# EAGLE design XRONOS_CLOCK_V2.1 (EAGLE 6.3)
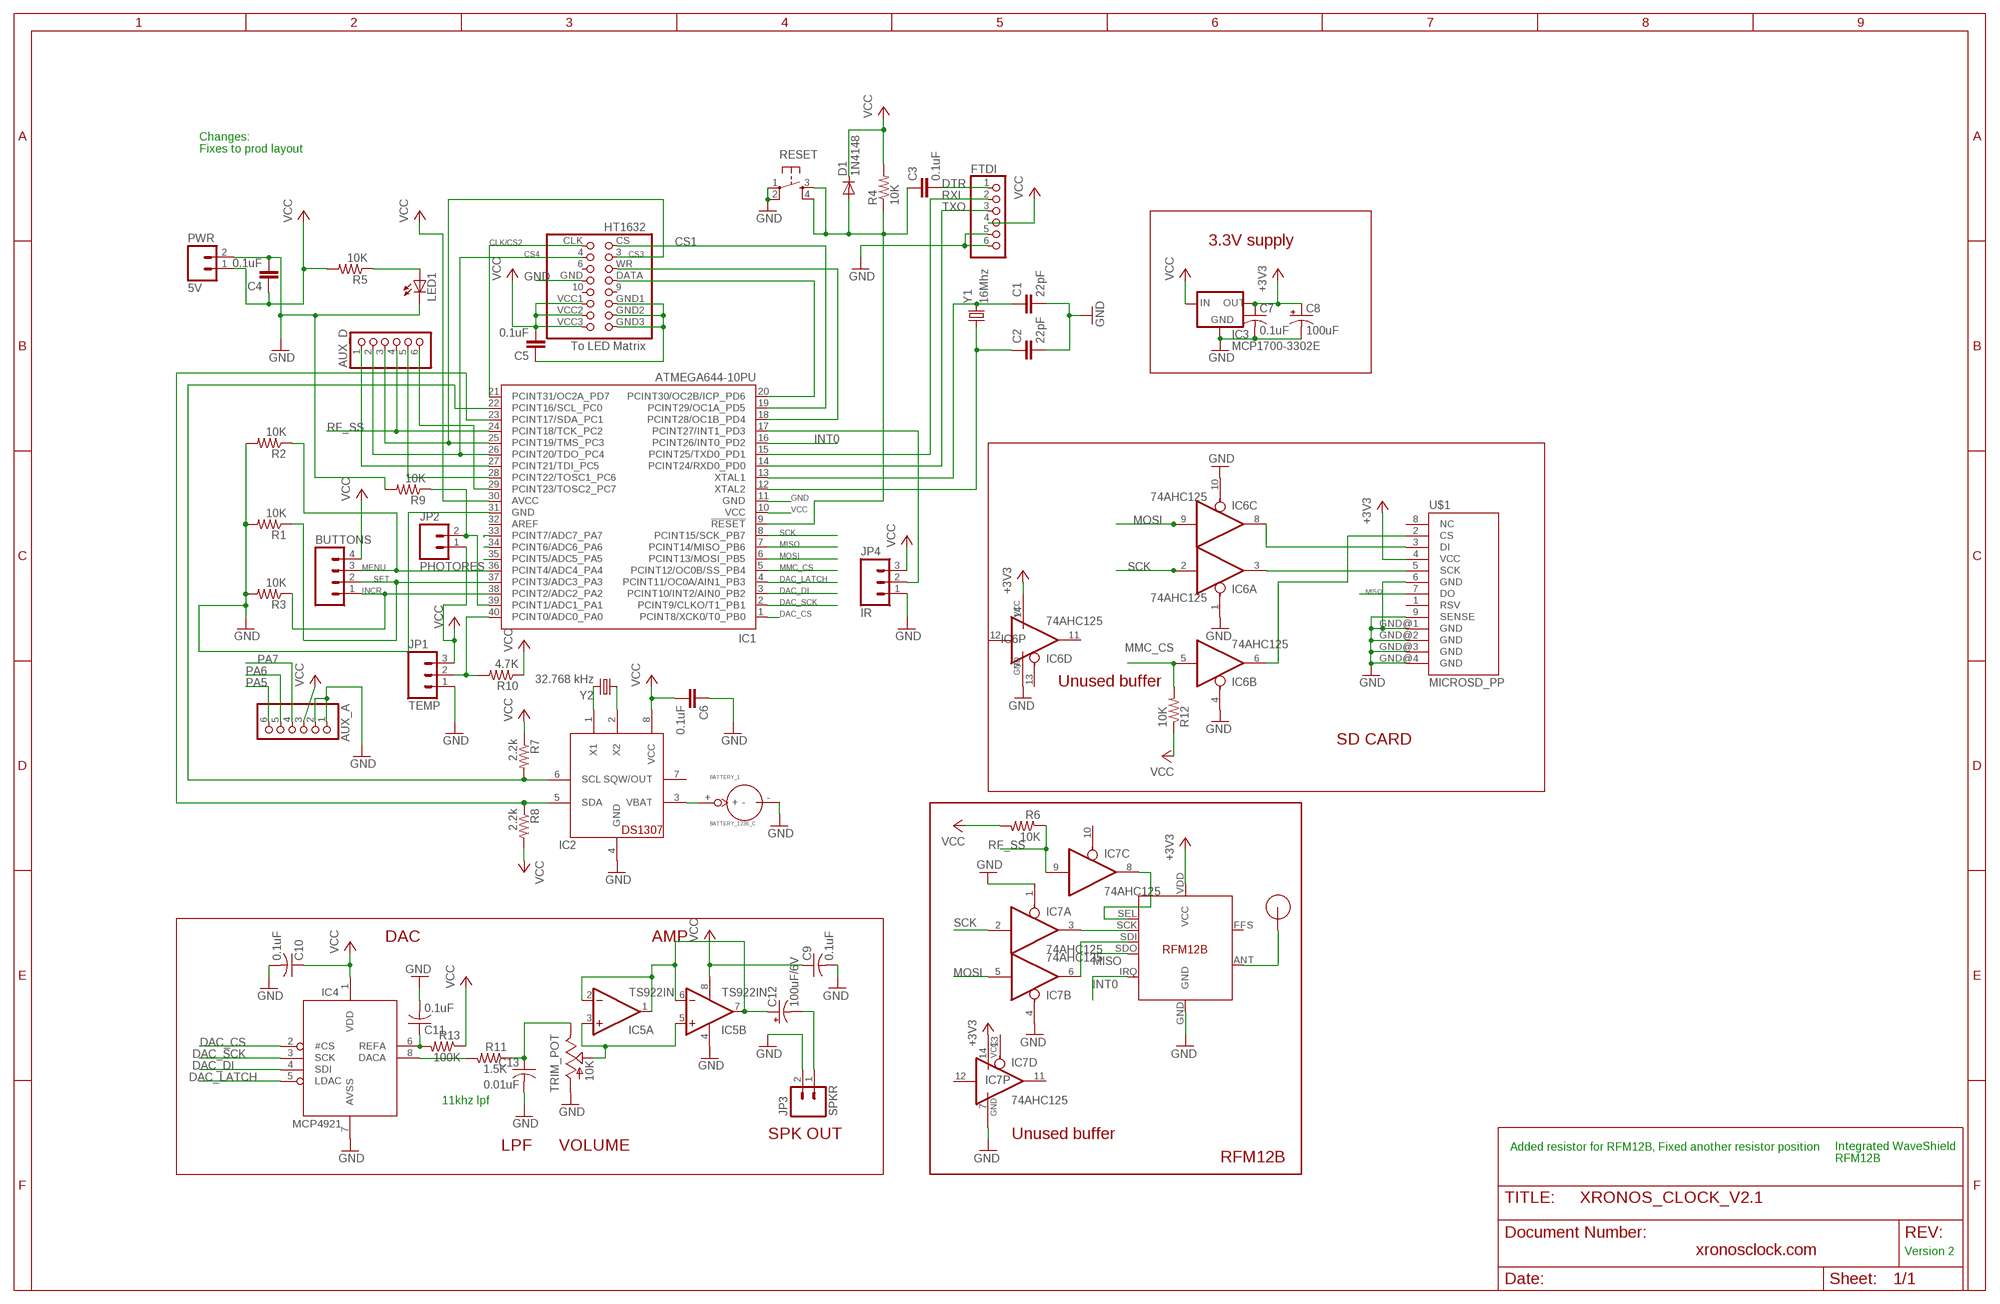
[diagram p0: schematic, sheet 1]

## Parts
AUX_A  PINHD-1X6  [1X06]
AUX_D  PINHD-1X6  [1X06]
BATTERY_1  BATTERY_1236_C  [BATTERY_1236_C]
BUTTONS  M04POLAR  [MOLEX-1X4]
C1  22pF  C-EU025-024X044  [C025-024X044]
C2  22pF  C-EU025-024X044  [C025-024X044]
C3  0.1uF  C-EU025-024X044  [C025-024X044]
C4  0.1uF  C-EU025-024X044  [C025-024X044]
C5  0.1uF  C-EU025-024X044  [C025-024X044]
C6  0.1uF  C-EU025-024X044  [C025-024X044]
C7  0.1uF  C-US025-025X050  [C025-025X050]
C8  100uF  CPOL-USE2.5-5  [E2,5-5]
C9  0.1uF  C-US025-025X050  [C025-025X050]
C10  0.1uF  C-US025-025X050  [C025-025X050]
C11  0.1uF  C-US025-025X050  [C025-025X050]
C12  100uF/6V  CPOL-USE2.5-5  [E2,5-5]
C13  0.01uF  C-US025-025X050  [C025-025X050]
D1  1N4148  1N4148DO35-7  [DO35-7]
FTDI  PINHD-1X6  [1X06]
HT1632  To LED Matrix  HT1632  [IDC2X08]
IC1  ATMEGA644-10PU  [DIL40]
IC2  DS1307  [DIL08]
IC3  MCP1700-3302E  MCP1700TRI  [TO92]
IC4  MCP4921  [DIL08]
IC5  TS922IN  TL072P  [DIL08]
IC6  74AHC125  74125N-LARDO  [DIL14-LARDO]
IC7  74AHC125  74125N  [DIL14]
JP1  TEMP  M03POLAR  [MOLEX-1X3]
JP2  PHOTORES  M02POLAR  [MOLEX-1X2]
JP3  SPKR  M02POLAR  [MOLEX-1X2]
JP4  IR  M03POLAR_LOCK  [MOLEX-1X3_LOCK]
LED1  LED-3MM-NO_SILK  [LED3MM-NS]
PWR  5V  M02POLAR  [MOLEX-1X2]
R1  10K  RESISTOREZ  [AXIAL-0.3EZ]
R2  10K  RESISTOREZ  [AXIAL-0.3EZ]
R3  10K  RESISTOREZ  [AXIAL-0.3EZ]
R4  10K  RESISTOREZ  [AXIAL-0.3EZ]
R5  10K  RESISTOREZ  [AXIAL-0.3EZ]
R6  10K  RESISTORAXIAL-0.3  [AXIAL-0.3]
R7  2.2k  RESISTOREZ  [AXIAL-0.3EZ]
R8  2.2k  RESISTOREZ  [AXIAL-0.3EZ]
R9  10K  RESISTOREZ  [AXIAL-0.3EZ]
R10  4.7K  RESISTOREZ  [AXIAL-0.3EZ]
R11  1.5K  RESISTORAXIAL-0.3  [AXIAL-0.3]
R12  10K  RESISTORAXIAL-0.3  [AXIAL-0.3]
R13  100K  RESISTORAXIAL-0.3  [AXIAL-0.3]
RESET  TAC_SWITCHPTH  [TACTILE-PTH]
TRIM_POT  10K  TRIM_US-B25P  [B25P]
U$1  MICROSD_PP  [MICROSD_PP]
U$2  RFM12B  [RFM12B]
U$3  RFM12B_ANTENNA  [RFM12B-ANTENNA]
Y1  16Mhz  CRYSTALHC49US  [HC49US]
Y2  32.768 kHz  CRYSTALTC26H_EZ  [TC26HEZ]

## Nets
+3V3: C7.1 C8.+ IC3.3(OUT) IC6.14(P:VCC) IC7.14(P:VCC) U$1.4(VCC) U$2.VDD(VCC)
ADJ: IC1.40(PCINT0/ADC0_PA0) JP1.2 R10.P$2
CLK/CS2: HT1632.CLK IC1.21(PCINT31/OC2A_PD7)
CS1: HT1632.CS IC1.19(PCINT29/OC1A_PD5)
CS3: AUX_D.3 HT1632.3 IC1.25(PCINT19/TMS_PC3)
CS4: AUX_D.2 HT1632.4 IC1.26(PCINT20/TDO_PC4)
DAC_CS: IC1.1(PCINT8/XCK0/T0_PB0) IC4.2(#CS)
DAC_DI: IC1.3(PCINT10/INT2/AIN0_PB2) IC4.4(SDI)
DAC_LATCH: IC1.4(PCINT11/OC0A/AIN1_PB3) IC4.5(LDAC)
DAC_SCK: IC1.2(PCINT9/CLKO/T1_PB1) IC4.3(SCK)
DATA: HT1632.DATA IC1.20(PCINT30/OC2B/ICP_PD6)
DTR: C3.2 FTDI.1
GND: AUX_A.1 AUX_A.2 BATTERY_1.- C1.2 C2.2 C4.2 C6.1 C7.2 C8.- C9.2 C10.2 C11.2 C13.2 FTDI.5 FTDI.6 HT1632.GND IC1.11(GND) IC1.31(GND) IC2.4(GND) IC3.1(GND) IC4.7(AVSS) IC5.4(P:V-) IC6.1(A:OE) IC6.4(B:OE) IC6.7(P:GND) IC6.10(C:OE) IC7.1(A:OE) IC7.4(B:OE) IC7.7(P:GND) JP1.1 JP3.2 JP4.1 LED1.K(C) PWR.2 R1.P$2 R2.P$2 R3.P$2 R9.P$2 RESET.1 RESET.2 TRIM_POT.A U$1.6(GND) U$1.9(SENSE) U$1.GND@1(GND) U$1.GND@2(GND) U$1.GND@3(GND) U$1.GND@4(GND) U$2.GND
INCR: BUTTONS.1 IC1.38(PCINT2/ADC2_PA2) R3.P$1
INT0: IC1.16(PCINT26/INT0_PD2) U$2.IRQ
MENU: BUTTONS.3 IC1.36(PCINT4/ADC4_PA4) R2.P$1
MISO: IC1.7(PCINT14/MISO_PB6) U$1.7(DO) U$2.SDO
MMC_CS: IC1.5(PCINT12/OC0B/SS_PB4) IC6.5(B:I) R12.P$2
MOSI: IC1.6(PCINT13/MOSI_PB5) IC6.9(C:I) IC7.5(B:I)
N$2: U$2.ANT U$3.P$1
N$3: C5.1 HT1632.GND1 HT1632.GND2 HT1632.GND3
N$4: IC2.2(X2) Y2.1
N$5: IC2.1(X1) Y2.2
N$6: C1.1 IC1.13(XTAL1) Y1.2
N$7: BATTERY_1.+ IC2.3(VBAT)
N$8: IC7.8(C:O) U$2.SEL
N$9: IC1.17(PCINT27/INT1_PD3) JP4.2
N$11: C2.1 IC1.12(XTAL2) Y1.1
N$13: AUX_D.1 IC1.27(PCINT21/TDI_PC5)
N$14: IC1.39(PCINT1/ADC1_PA1) JP2.2 R9.P$1
N$15: AUX_D.5 IC1.28(PCINT22/TOSC1_PC6)
N$16: AUX_D.6 IC1.29(PCINT23/TOSC2_PC7)
N$17: IC6.8(C:O) U$1.3(DI)
N$18: LED1.A R5.P$1
N$19: IC6.3(A:O) U$1.5(SCK)
N$20: IC6.6(B:O) U$1.2(CS)
N$21: IC4.8(DACA) R11.P$2
N$22: C12.- JP3.1
N$23: C12.+ IC5.1(A:OUT) IC5.2(A:-IN) IC5.6(B:-IN) IC5.7(B:OUT)
N$24: C11.1 IC4.6(REFA) R13.P$2
N$25: IC5.3(A:+IN) IC5.5(B:+IN) TRIM_POT.S
N$26: C13.1 R11.P$1 TRIM_POT.E
N$28: IC7.6(B:O) U$2.SDI
N$30: IC7.3(A:O) U$2.SCK
PA5: AUX_A.6 IC1.35(PCINT5/ADC5_PA5)
PA6: AUX_A.5 IC1.34(PCINT6/ADC6_PA6)
PA7: AUX_A.4 IC1.33(PCINT7/ADC7_PA7)
RESET: C3.1 D1.A IC1.9(!RESET) R4.P$1 RESET.3 RESET.4
RF_SS: AUX_D.4 IC1.24(PCINT18/TCK_PC2) IC7.9(C:I) R6.P$1
RXI: FTDI.2 IC1.15(PCINT25/TXD0_PD1)
SCK: IC1.8(PCINT15/SCK_PB7) IC6.2(A:I) IC7.2(A:I)
SCL: IC1.23(PCINT17/SDA_PC1) IC2.5(SDA) R8.P$1
SDA: IC1.22(PCINT16/SCL_PC0) IC2.6(SCL) R7.P$2
SET: BUTTONS.2 IC1.37(PCINT3/ADC3_PA3) R1.P$1
TXO: FTDI.3 IC1.14(PCINT24/RXD0_PD0)
VCC: AUX_A.3 BUTTONS.4 C4.1 C5.2 C6.2 C9.1 C10.1 D1.C FTDI.4 HT1632.VCC1 HT1632.VCC2 HT1632.VCC3 IC1.10(VCC) IC1.30(AVCC) IC2.8(VCC) IC3.2(IN) IC4.1(VDD) IC5.8(P:V+) JP1.3 JP2.1 JP4.3 PWR.1 R4.P$2 R5.P$2 R6.P$2 R7.P$1 R8.P$2 R10.P$1 R12.P$1 R13.P$1
WR: HT1632.WR IC1.18(PCINT28/OC1B_PD4)
Unconnected: HT1632.6 HT1632.9 HT1632.10 IC1.32(AREF) IC2.7(SQW/OUT) IC6.11(D:O) IC6.12(D:I) IC6.13(D:OE) IC7.10(C:OE) IC7.11(D:O) IC7.12(D:I) IC7.13(D:OE) U$1.1(RSV) U$1.8(NC) U$2.FFS

## Notes on the sheet
- Changes:
  Fixes to prod layout
- 3.3V supply
- Unused buffer
- SD CARD
- DAC | AMP
- 11khz lpf
- SPK OUT | Unused buffer
- LPF | VOLUME | Added resistor for RFM12B, Fixed another resistor position
- RFM12B
- Integrated WaveShield
  RFM12B
- xronosclock.com | Version 2

## Library data of the parts
AUX_A AUX_D FTDI = pinhead:PINHD-1X6: PIN HEADER
BATTERY_1 = Itead_BP_110825:BATTERY_1236_C: SOC004
BUTTONS = SparkFun-Connectors:M04: Header 4 Standard 4-pin 0.1" header. Use with straight break away headers (SKU : PRT-00116), right angle break away headers (PRT-00553), swiss pins (PRT-00743), machine pins (PRT-00117), and female headers (PRT-00115). Molex polarized connector foot print use with SKU : PRT-08231 with associated crimp pins and housings. 1MM SMD Version SKU: PRT-10208
C1-C6 = rcl:C-EU: CAPACITOR, European symbol
C7 C9-C11 C13 = adafruit:C-US: CAPACITOR, American symbol
C8 C12 = adafruit:CPOL-US: POLARIZED CAPACITOR, American symbol
D1 = diode:1N4148: DIODE high speed (Philips)
HT1632 = bratan_headers:HT1632: 2x8 IDC Male Socket
IC1 = atmel:ATMEGA644-*PU: 8-bit Microcontroller with 64K Bytes In-System Programmable Flash Auto generated by make-symbol-device-package-bsdl.ulp Rev. 34 Source: http://www.atmel.com/dyn/resources/prod_documents/doc2593.pdf; MPN: ATMEGA644V-10PU; OC_FARNELL: 1288342; OC_NEWARK: 23M5062
IC2 = adafruit:DS1307: DS1307 Real time clock (RTC) with battery backup ability. Talk to it via i2c
IC3 = adafruit:MCP1700: VOLTAGE REGULATOR
IC4 = adafruit:MCP4921
IC5 = linear:TL072: OP AMP
IC6 = adafruit:74*125: Quad bus BUFFER, 3-state
IC7 = 74xx-us:74*125: Quad bus BUFFER, 3-state
JP1 JP4 = SparkFun-Connectors:M03: Header 3 Standard 3-pin 0.1" header. Use with straight break away headers (SKU : PRT-00116), right angle break away headers (PRT-00553), swiss pins (PRT-00743), machine pins (PRT-00117), and female headers (PRT-00115). Molex polarized connector foot print use with SKU : PRT-08232 with associated crimp pins and housings.
JP2 JP3 PWR = SparkFun-Connectors:M02: Header 2 Standard 2-pin 0.1" header. Use with straight break away headers (SKU : PRT-00116), right angle break away headers (PRT-00553), swiss pins (PRT-00743), machine pins (PRT-00117), and female headers (PRT-00115). Molex polarized connector foot print use with SKU : PRT-08233 with associated crimp pins and housings.
LED1 = SparkFun-LED:LED: LEDs Standard schematic elements and footprints for 5mm, 3mm, 1206, and 0603 sized LEDs. 5mm - Spark Fun Electronics SKU : COM-00529 (and others)
R1-R13 = SparkFun-Resistors:RESISTOR: Resistor Basic schematic elements and footprints for 0603, 1206, and PTH resistors.
RESET = SparkFun-Electromechanical:TAC_SWITCH: Momentary Switch Button commonly used for reset or general input. Spark Fun Electronics SKU : COM-00097
TRIM_POT = pot:TRIM_US-: POTENTIOMETER
U$1 = DE1594-v2:MICROSD_PP
U$2 = JeeParts:RFM12B
U$3 = LowPowerLab:RFM12B_ANTENNA
Y1 Y2 = SparkFun-FreqCtrl:CRYSTAL: Various standard crystals. Proven footprints. Spark Fun Electronics SKU : COM-00534

## Board
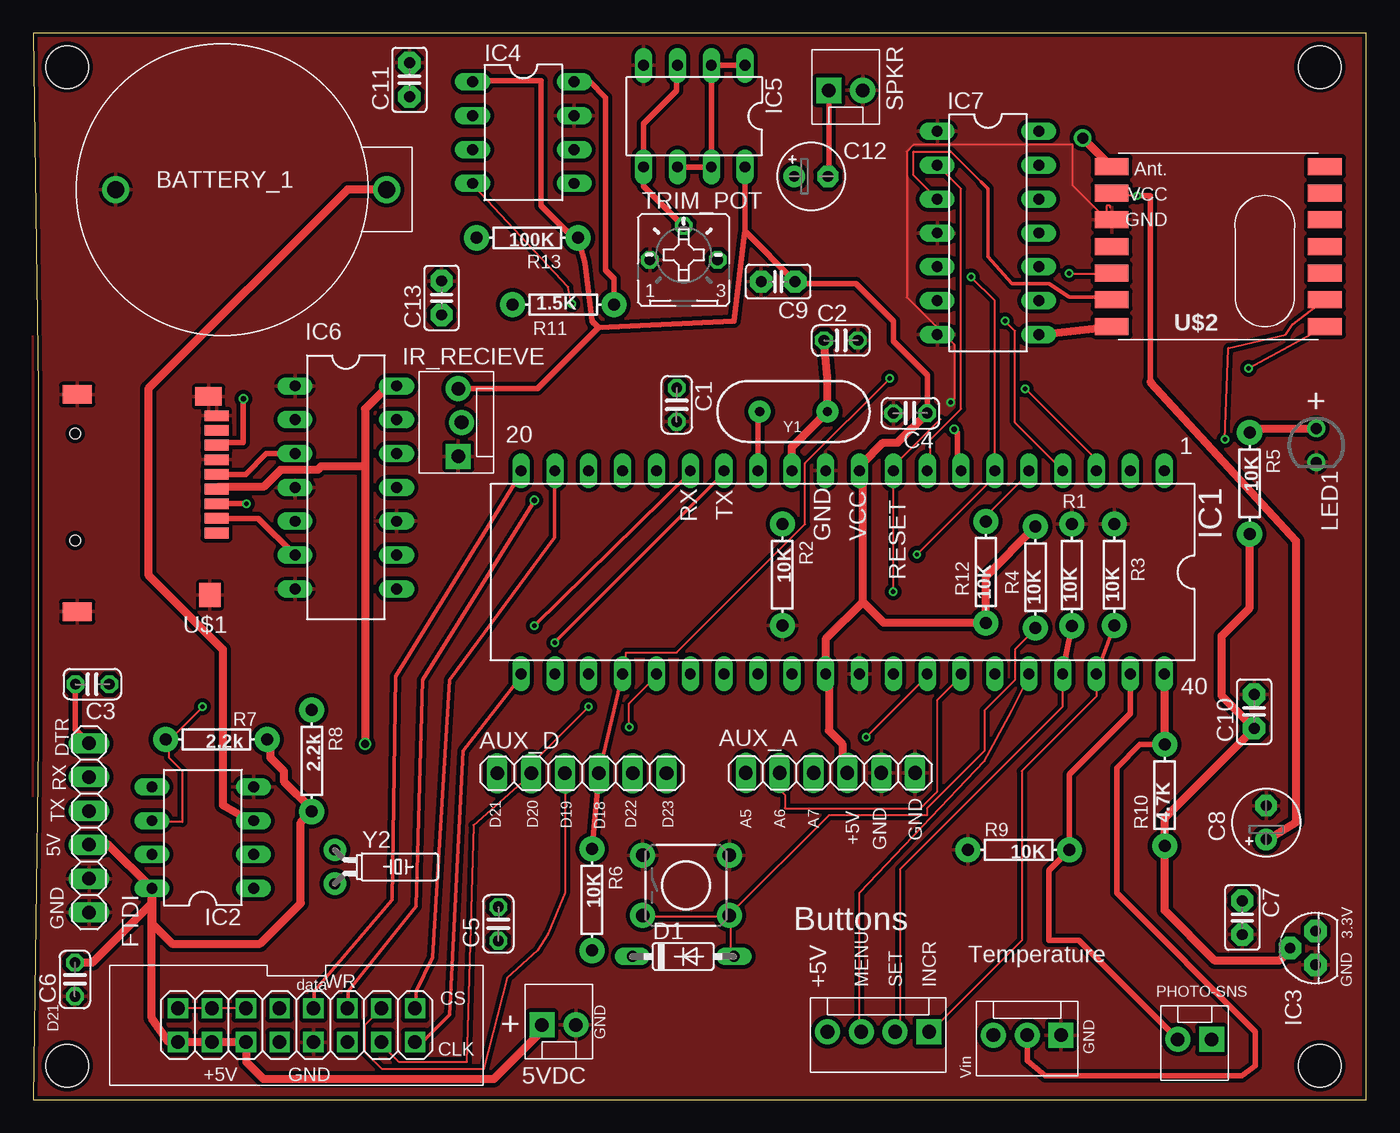
[diagram p1: board, top side]
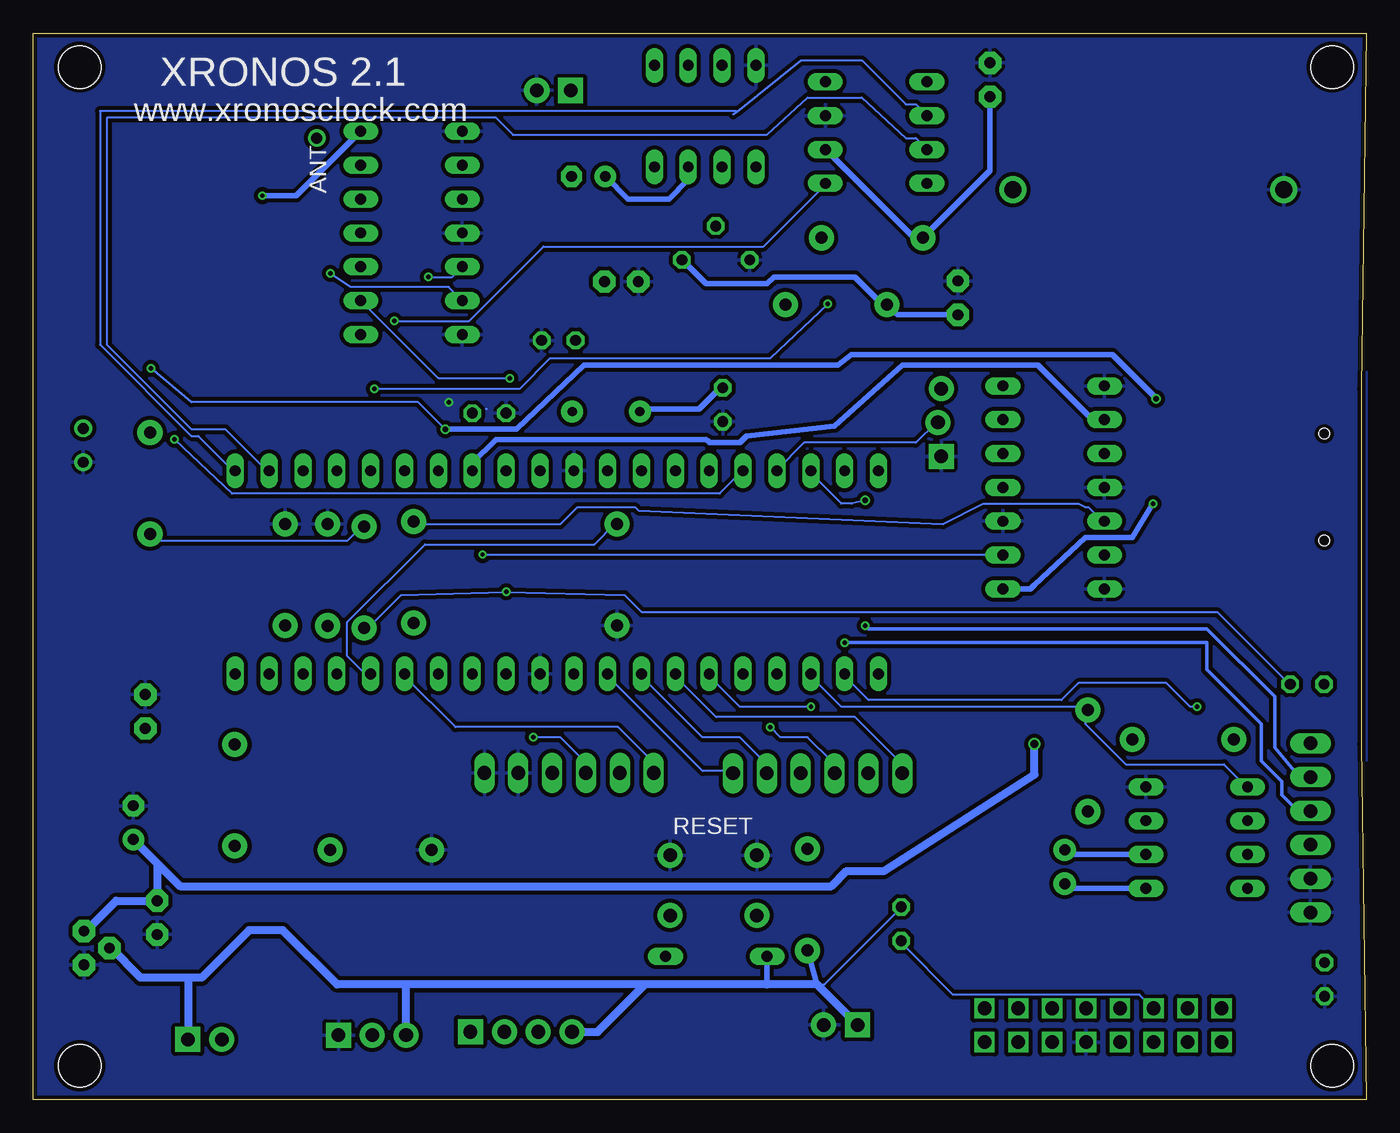
[diagram p2: board, bottom side, seen from below]

Size 100 x 80 mm. Coordinates in mm from the lower left corner, seen from the top.
Outline: 100,80 0,80 arc-2 0,0 100,0 100,80
Copper layers (1*16): Top 0.035mm / dielectric 1.5mm / Bottom 0.035mm
Design rules "ITEADstudio_DRC": minimum track width 6mil, minimum drill 12mil, track to track 6mil, track to pad 6mil, pad to pad 6mil, via to via 6mil, smd to smd 0mil, copper to edge 10mil, drill to drill 10mil, minimum pad ring 10mil, minimum via ring 6mil, stop-mask expansion 2mil, vias tented up to drill 100mil, thermal gap 10mil
Holes 3.2 mm at 96.52,2.54 2.54,2.54 2.54,77.47 96.52,77.47

### Footprints (pad centres in the part's own frame; a part is rotated, then mirrored left to right if it is on the bottom)
1X06 = drill 1.016 long: 1 -6.35,0; 2 -3.81,0; 3 -1.27,0; 4 1.27,0; 5 3.81,0; 6 6.35,0
BATTERY_1236_C = drill 1.27 pad 2.032: + 0,0; - 0,20.32
MOLEX-1X4 = drill 1.016 pad 1.88 square: 1 0,0 | drill 1.016 pad 1.88: 2 2.54,0; 3 5.08,0; 4 7.62,0
C025-024X044 = drill 0.813 octagon: 1 -1.27,0; 2 1.27,0
C025-025X050 = drill 0.813 pad 1.676 octagon: 1 -1.27,0; 2 1.27,0
E2,5-5 = drill 0.813 pad 1.6: + -1.27,0 | drill 0.813 pad 1.6 octagon: - 1.27,0
DO35-7 = drill 0.813 long: A 3.81,0; C -3.81,0
IDC2X08 = drill 1.016 square: 3 -6.35,-1.27; 4 -6.35,1.27; 6 -3.81,1.27; 9 1.27,-1.27; 10 1.27,1.27; CLK -8.89,1.27; CS -8.89,-1.27; DATA -1.27,-1.27; GND -1.27,1.27; GND1 3.81,-1.27; GND2 6.35,-1.27; GND3 8.89,-1.27; VCC1 3.81,1.27; VCC2 6.35,1.27; VCC3 8.89,1.27; WR -3.81,-1.27
DIL40 = drill 0.813 long: 1 -24.13,-7.62; 2 -21.59,-7.62; 3 -19.05,-7.62; 4 -16.51,-7.62; 5 -13.97,-7.62; 6 -11.43,-7.62; 7 -8.89,-7.62; 8 -6.35,-7.62; 9 -3.81,-7.62; 10 -1.27,-7.62; 11 1.27,-7.62; 12 3.81,-7.62; 13 6.35,-7.62; 14 8.89,-7.62; 15 11.43,-7.62; 16 13.97,-7.62; 17 16.51,-7.62; 18 19.05,-7.62; 19 21.59,-7.62; 20 24.13,-7.62; 21 24.13,7.62; 22 21.59,7.62; 23 19.05,7.62; 24 16.51,7.62; 25 13.97,7.62; 26 11.43,7.62; 27 8.89,7.62; 28 6.35,7.62; 29 3.81,7.62; 30 1.27,7.62; 31 -1.27,7.62; 32 -3.81,7.62; 33 -6.35,7.62; 34 -8.89,7.62; 35 -11.43,7.62; 36 -13.97,7.62; 37 -16.51,7.62; 38 -19.05,7.62; 39 -21.59,7.62; 40 -24.13,7.62
DIL08 = drill 0.813 long: 1 -3.81,-3.81; 2 -1.27,-3.81; 3 1.27,-3.81; 4 3.81,-3.81; 5 3.81,3.81; 6 1.27,3.81; 7 -1.27,3.81; 8 -3.81,3.81
TO92 = drill 0.813 pad 1.676 octagon: 1 -1.27,0; 2 0,1.905; 3 1.27,0
DIL14-LARDO = drill 0.813 long: 1 -7.62,-3.81; 2 -5.08,-3.81; 3 -2.54,-3.81; 4 0,-3.81; 5 2.54,-3.81; 6 5.08,-3.81; 7 7.62,-3.81; 8 7.62,3.81; 9 5.08,3.81; 10 2.54,3.81; 11 0,3.81; 12 -2.54,3.81; 13 -5.08,3.81; 14 -7.62,3.81
DIL14 = drill 0.813 long: 1 -7.62,-3.81; 2 -5.08,-3.81; 3 -2.54,-3.81; 4 0,-3.81; 5 2.54,-3.81; 6 5.08,-3.81; 7 7.62,-3.81; 8 7.62,3.81; 9 5.08,3.81; 10 2.54,3.81; 11 0,3.81; 12 -2.54,3.81; 13 -5.08,3.81; 14 -7.62,3.81
MOLEX-1X3 = drill 1.016 pad 1.88 square: 1 0,0 | drill 1.016 pad 1.88: 2 2.54,0; 3 5.08,0
MOLEX-1X2 = drill 1.016 pad 1.88 square: 1 0,0 | drill 1.016 pad 1.88: 2 2.54,0
MOLEX-1X3_LOCK = drill 1.016 pad 1.88 square: 1 0,0.127 | drill 1.016 pad 1.88: 2 2.54,-0.127; 3 5.08,0.127
LED3MM-NS = drill 0.813: A -1.27,0; K 1.27,0
AXIAL-0.3EZ = drill 0.9 pad 1.88: P$1 -3.81,0; P$2 3.81,0
AXIAL-0.3 = drill 0.9 pad 1.88: P$1 -3.81,0; P$2 3.81,0
TACTILE-PTH = drill 1.016 pad 1.88: 1 -3.251,2.261; 2 3.251,2.261; 3 -3.251,-2.261; 4 3.251,-2.261
B25P = drill 0.813 octagon: A -2.54,0; E 2.54,0; S 0,2.54
MICROSD_PP = smd 1.8 x 0.8: 1 0,3.85; 2 0,2.75; 3 0,1.65; 4 0,0.55; 5 0,-0.55; 6 0,-1.65; 7 0,-2.75; 8 0,-3.85; 9 0,-4.95 | smd 1.6 x 1.8: GND@1 0.5,8.5 | smd 2.2 x 1.4: GND@2 10.45,9.75; GND@4 10.45,-6.55 | smd 2 x 1.4: GND@3 0.6,-6.4 | hole 0.8: 10.6,4.4; 10.6,-3.6
RFM12B = smd 2.54 x 1.27: ANT 8,-6; FFS -8,2; GND 8,-2; IRQ -8,4; P$8 -8,0; P$9 -8,-2; P$10 -8,-4; P$12 -8,-6; P$16 8,0; SCK 8,4; SDI 8,2; SDO -8,6; SEL 8,6; VDD 8,-4
RFM12B-ANTENNA = drill 0.8: P$1 0,0
HC49US = drill 0.7 pad 1.651: 1 -2.54,0; 2 2.54,0
TC26HEZ = drill 0.813 pad 1.676: 1 -1.27,0; 2 1.27,0

### Placement (x,y rotation side)
AUX_A  59.81,24.51 180 top
AUX_D  41.16,24.47 0 top
BATTERY_1  26.5,68.28 90 top
BUTTONS  67.2,5.08 180 top
C1  48.27,52.13 270 top
C2  60.59,56.96 0 top
C3  4.43,31.16 180 top
C4  65.8,51.5 180 top
C5  34.89,13.18 90 top
C6  3.12,9.01 90 top
C7  90.71,13.65 270 top
C8  92.5,20.78 90 top
C9  55.88,61.37 180 top
C10  91.59,29.11 90 top
C11  28.22,76.51 90 top
C12  58.35,69.27 0 top
C13  30.63,60.15 90 top
D1  48.76,10.73 0 top
FTDI  4.18,20.38 270 top
HT1632  19.75,5.57 180 top
IC1  60.72,39.56 180 top
IC2  12.71,19.65 90 top
IC3  96.2,11.36 90 top
IC4  36.77,72.55 270 top
IC5  49.6,73.78 180 top
IC6  23.45,45.93 270 top
IC7  71.63,65.02 270 top
JP1  77.11,4.83 180 top
JP2  88.4,4.51 180 top
JP3  59.69,75.71 0 top
JP4  32,48.26 90 top
LED1  96.25,49.09 270 top
PWR  38.16,5.6 0 top
R1  77.91,39.36 90 top
R2  56.2,39.38 270 top
R3  81.09,39.38 90 top
R4  75.2,39.18 90 top
R5  91.25,46.24 270 top
R6  41.91,14.99 270 top
R7  13.73,27.02 180 top
R8  20.89,25.41 270 top
R9  73.93,18.73 180 top
R10  84.88,22.83 90 top
R11  39.77,59.65 0 top
R12  71.46,39.57 90 top
R13  37.07,64.65 180 top
RESET  48.97,16.07 0 top
TRIM_POT  48.8,63 0 top
U$1  13.75,46.35 180 top
U$2  88.9,64.01 180 top
U$3  78.74,72.14 0 top
Y1  57.03,51.62 180 top
Y2  22.62,17.46 270 top

### Tracks (layer width: path | path; a pad name or v marks a point on that pad's centre or on a via)
+3V3  (via drill 0.33, 0.61)
  Top 0.152: 13.97,45.97 U$1.4 | v82.8,67.82 81.03,67.82 U$2.VDD | 92.71,19.56 C8.+
  Top 0.406: v82.8,67.82 83.82,67.82 83.82,53.85
  Top 0.61: IC6.14 27.18,53.34 26.42,53.34 24.89,51.82 24.89,47.5 | 24.89,47.5 v24.89,26.67 | 24.89,47.5 21.59,47.5 21.34,47.24 18.54,47.24 17.27,45.97 13.92,45.97 U$1.4 | 83.82,53.85 94.74,41.91 94.74,20.83 92.71,19.56
  Bottom 0.152: 38.73,17.14 38.86,17.02 | IC3.3 96.27,12.7 96.01,12.7
  Bottom 0.406: IC7.14 80.26,67.82 v82.8,67.82
  Bottom 0.61: 96.01,12.7 93.79,14.92 C7.1 90.71,17.72 | C8.+ 90.71,17.72 | 90.71,17.72 88.99,16 40.13,16 38.99,17.14 38.73,17.14 36.2,17.14 24.89,24.38 v24.89,26.67
ADJ
  Top 0.406: JP1.2 74.57,2.9 75.95,1.78 90.68,1.78 91.69,2.54 91.69,5.08 81.28,15.49 81.28,24.89 83.03,26.64 R10.P$2
  Top 0.61: R10.P$2 84.88,31.91 IC1.40
CLK/CS2
  Top 0.254: IC1.21 36.58,31.75 32.26,26.16 31.24,6.35 29.21,4.32 28.65,4.32 HT1632.CLK
CS1
  Top 0.152: 28.7,6.86 HT1632.CS
  Top 0.254: 28.7,6.86 28.7,8.13 29.97,10.67 31.24,31.5 39.12,42.16 39.12,46.99 IC1.19
CS3  (via drill 0.33)
  Top 0.152: v44.7,27.94 44.7,29.72 46.74,31.75 IC1.25 | HT1632.3 25.91,6.6 24.89,5.59 24.89,3.56 26.16,2.29 33.78,2.29 35.56,9.14 37.85,11.18 38.61,12.45 39.88,15.49 39.88,24.38 AUX_D.3
  Bottom 0.152: v44.7,27.94 43.94,27.18 41.91,27.18 40.13,25.4 40.13,24.64 AUX_D.3
CS4  (via drill 0.33)
  Top 0.152: v41.66,29.46 37.59,25.4 37.59,24.64 AUX_D.2 37.34,24.38 33.02,20.57 32.51,2.79 27.43,2.79 26.16,4.06 HT1632.4
  Bottom 0.152: v41.66,29.46 46.99,29.46 49.28,31.75 IC1.26
DAC_CS
  Top 0.152: 84.84,47.24 IC1.1
  Bottom 0.152: 47.5,73.91 47.22,74.14 | 47.22,74.14 42.42,77.98 37.85,77.98 34.54,74.68 33.78,74.68 33.02,73.91 IC4.2 | IC1.1 85.09,47.24 87.63,49.78 88.14,49.78 95,56.64 95,74.17 47.24,74.17 47.22,74.14
DAC_DI  (via drill 0.33)
  Top 0.152: v40.39,59.69 40.13,60.96 33.02,68.58 IC4.4 | v74.42,53.34 79.76,48.01 79.76,47.24 IC1.3
  Bottom 0.152: v40.39,59.69 44.7,55.63 61.21,55.63 63.5,53.34 v74.42,53.34
DAC_LATCH  (via drill 0.33)
  Top 0.152: v72.9,58.42 73.66,57.66 73.66,50.8 77.22,47.24 IC1.4
  Bottom 0.152: v72.9,58.42 67.31,58.42 61.72,64.01 45.21,64.01 40.64,68.58 IC4.5
DAC_SCK
  Top 0.152: 82.3,47.24 IC1.2
  Bottom 0.152: IC4.3 33.02,71.37 33.78,72.14 34.54,72.14 37.85,75.18 41.91,75.18 44.96,72.39 64.01,72.39 65.28,73.66 94.49,73.66 94.49,56.64 88.14,50.29 85.6,50.29 82.55,47.24 IC1.2
DATA
  Top 0.152: 21.08,6.86 HT1632.DATA
  Top 0.254: 21.08,6.86 21.08,8.13 26.92,14.99 27.18,31.75 36.58,46.99 IC1.20
DTR
  Top 0.406: FTDI.1 3.16,27.75 C3.2
GND  (via drill 0.33)
  Top 0.152: U$2.GND 81.03,66.04 81.03,66.14 | 81.03,66.29 U$2.GND | v68.83,52.32 69.09,52.58 69.09,56.64 65.53,60.2 65.53,71.12 66.04,71.63 77.98,71.63 77.98,68.58 80.26,66.29 80.52,66.29 80.52,67.06 80.77,67.06 80.77,66.94 | U$2.GND 80.77,66.04 80.77,66.14
  Bottom 0.152: 66.04,51.82 65.98,51.82 | C4.2 64.52,51.56 64.6,51.56
  pour Top (isolate 0.305): 0,80 100,80 100,0 0,0
  pour Bottom (isolate 0.305): 0,80 100,80 100,0 0,0
INCR
  Top 0.152: BUTTONS.1 67.31,5.08 74.17,11.94 74.17,24.64 79.76,30.23 79.76,31.75 IC1.38
  Top 0.254: IC1.38 R3.P$1
INT0  (via drill 0.33)
  Top 0.152: v89.41,49.53 89.66,56.39 93.98,57.4 94.49,58.17 96.77,59.94 U$2.IRQ
  Bottom 0.152: v89.41,49.53 85.09,45.47 48.51,45.47 46.99,46.99 IC1.16
MENU
  Top 0.152: IC1.36 74.68,31.75 73.41,29.21 71.37,25.4 61.98,15.49 61.98,5.08 BUTTONS.3
  Bottom 0.152: R2.P$1 56.39,43.18 57.91,41.66 70.61,41.66 76.45,35.81 76.45,33.27 75.18,32 74.93,32 IC1.36
MISO  (via drill 0.33, 0.41)
  Top 0.152: 13.97,49.28 U$1.7 | v91.19,54.86 96.77,57.91 U$2.SDO
  Top 0.406: 13.97,49.28 15.75,49.28 v15.75,52.58 | v69.09,50.29 69.34,50.04 69.34,47.5 69.6,47.24 IC1.7
  Bottom 0.152: v91.19,54.86 88.14,52.32 71.12,52.32 v69.09,50.29
  Bottom 0.406: v15.75,52.58 19.05,55.88 38.61,55.88 39.62,55.12 58.67,55.12 63.75,50.29 v69.09,50.29
MMC_CS
  Top 0.152: IC1.5 74.68,46.99 71.63,43.94 71.63,43.43 R12.P$2
  Bottom 0.152: IC6.5 19.81,43.43 20.83,44.45 21.08,44.45 21.59,44.7 28.7,44.7 31.75,43.18 54.61,44.2 54.86,44.45 59.18,44.45 60.45,43.18 71.37,43.18 R12.P$2
MOSI  (via drill 0.33)
  Top 0.152: v66.29,40.89 72.14,46.74 72.14,46.99 IC1.6 72.14,47.24 72.14,59.94 v70.36,61.72
  Bottom 0.152: v66.29,40.89 27.43,40.89 IC6.9 | IC7.5 68.58,61.72 v70.36,61.72
N$2
  Top 0.61: U$2.ANT 80.87,70.01 U$3.P$1
N$3
  Top 0.152: HT1632.GND3 10.92,6.86 13.21,6.86 HT1632.GND2 13.46,6.86 15.75,6.86 HT1632.GND1
  Bottom 0.152: C5.1 34.8,11.68 30.99,7.87 17.02,7.87 16,6.86 HT1632.GND1
N$4
  Bottom 0.406: IC2.2 22.27,18.38 Y2.1
N$5
  Bottom 0.406: IC2.1 22.27,15.84 Y2.2
N$6
  Top 0.152: 54.36,47.24 IC1.13
  Top 0.406: 54.36,47.24 54.36,51.56 Y1.2
  Bottom 0.406: C1.1 48.51,53.34 50.04,51.82 54.36,51.82 Y1.2
N$7
  Top 0.61: BATTERY_1.+ 23.57,68.28 8.64,53.34 8.64,39.37 14.22,33.78 14.22,22.1 16.43,20.83 IC2.3
N$8
  Top 0.61: IC7.8 U$2.SEL
N$9
  Bottom 0.152: IC1.17 44.2,47.24 42.16,49.28 33.78,49.28 32.26,50.8 JP4.2
N$11
  Top 0.61: IC1.12 56.91,48.96 Y1.1 59.58,54.16 C2.1
N$13
  Bottom 0.152: IC1.27 51.82,31.75 48.77,28.7 38.35,28.7 35.05,25.4 35.05,24.64 AUX_D.1
N$14
  Top 0.406: IC1.39 82.31,28.97 77.74,24.4 R9.P$1 76.2,17.2 76.2,11.94 78.43,11.94 JP2.2
N$15
  Bottom 0.152: IC1.28 54.36,31.75 49.78,27.18 46.99,27.18 45.21,25.4 45.21,24.64 AUX_D.5
N$16
  Bottom 0.152: IC1.29 56.9,31.75 49.78,24.64 47.75,24.64 AUX_D.6
N$17  (via drill 0.33)
  Top 0.406: v16,44.7 U$1.3
  Bottom 0.406: v16,44.7 17.53,42.16 21.08,42.16 24.89,38.61 25.19,38.31 IC6.8
N$18
  Top 0.61: R5.P$1 91.56,50.36 LED1.A
N$19
  Top 0.406: U$1.5 15.92,46.9 17.48,48.47 IC6.3
N$20
  Top 0.406: IC6.6 16.88,43.6 U$1.2
N$21
  Top 0.406: IC4.8 41.75,76.36 42.93,75.18 42.93,62.23 43.58,61.58 R11.P$2
N$22
  Top 0.406: C12.- 59.69,69.33 JP3.1
N$23
  Top 0.406: IC5.1 IC5.2 IC5.7 IC5.6
  Bottom 0.406: C12.+ 55.38,67.56 52.32,67.56 50.87,69.02 IC5.7
N$24
  Bottom 0.152: 33.27,64.77 R13.P$2 33.02,64.77
  Bottom 0.406: 33.27,64.77 34.04,64.77 40.39,71.12 IC4.6 | C11.1 28.22,69.69 R13.P$2
N$25
  Top 0.406: TRIM_POT.S 45.79,68.55 IC5.5 45.79,73.22 48.26,75.69 48.26,77.53 IC5.3
N$26
  Bottom 0.152: 51.31,62.99 TRIM_POT.E | 36.07,59.69 R11.P$1
  Bottom 0.406: 51.31,62.99 49.53,61.21 44.96,61.21 44.45,61.72 38.35,61.72 36.32,59.69 36.07,59.69 | C13.1 35.19,58.88 R11.P$1
N$28  (via drill 0.33)
  Top 0.152: v77.72,61.98 80.77,61.98 U$2.SDI
  Bottom 0.152: v77.72,61.98 76.2,60.96 68.83,60.96 IC7.6
N$30
  Top 0.152: 71.12,68.83 68.83,71.12 66.04,71.12 66.04,69.34 IC7.3 | 80.77,60.2 U$2.SCK
  Top 0.254: 80.77,60.2 77.72,60.2 76.2,61.21 73.41,61.21 71.63,63.25 71.63,68.33 71.12,68.83
PA5
  Bottom 0.152: IC1.35 72.14,31.75 68.33,27.94 56.13,27.94 53.59,25.4 53.59,24.64 AUX_A.6
PA6
  Top 0.152: IC1.34 69.6,31.75 67.82,29.97 67.82,23.11 66.55,21.84 56.39,21.84 56.39,22.86 56.13,23.11 56.13,24.38 AUX_A.5
PA7  (via drill 0.33)
  Top 0.152: v62.48,27.18 67.06,31.75 IC1.33
  Bottom 0.152: v62.48,27.18 60.45,27.18 58.67,25.4 58.67,24.64 AUX_A.4
RESET  (via drill 0.33)
  Top 0.152: v64.52,38.1 64.52,46.99 IC1.9 64.77,47.24 64.77,47.75 68.07,51.05 | RESET.4 52.32,13.72 52.32,10.92 D1.A | RESET.3 45.72,13.72 52.07,13.72 RESET.4 | RESET.4 52.32,13.97 59.69,21.34 67.06,21.34 67.06,21.84 71.37,26.16 71.37,29.21 73.66,31.5 73.66,33.78 75.18,35.31 R4.P$1
  Bottom 0.152: C3.1 5.84,31.24 11.18,36.58 54.36,36.58 55.63,37.85 v64.52,38.1 72.39,37.85 74.68,35.56 75.18,35.56 R4.P$1
RF_SS  (via drill 0.33)
  Top 0.152: v64.26,54.1 57.91,47.75 57.91,43.18 48.26,33.53 44.45,33.53 44.45,32 IC1.24
  Top 0.254: AUX_D.4 IC1.24
  Top 0.406: AUX_D.4 R6.P$1
  Bottom 0.152: IC7.9 69.6,54.1 v64.26,54.1
RXI  (via drill 0.33)
  Top 0.152: 49.28,46.99 IC1.15
  Top 0.254: v37.59,35.56 49.28,46.99
  Bottom 0.152: 37.34,35.31 v37.59,35.56
  Bottom 0.254: 37.34,35.31 11.94,35.31 6.86,30.23 6.86,26.42 5.59,24.89 4.89,24.19 FTDI.2
SCK
  Top 0.152: IC7.2 69.6,68.33 69.6,51.82 67.31,49.53 67.31,47.24 IC1.8
  Bottom 0.152: 49.02,49.28 49.28,49.53 49.53,49.53
  Bottom 0.406: IC6.2 20.53,51.01 24.64,55.12 34.8,55.12 39.88,50.55 46.48,49.78 46.99,49.28 49.28,49.28 49.53,49.53 65.28,49.53 67.07,47.74 IC1.8
SCL
  Bottom 0.152: IC2.5 9.14,23.62 10.67,25.15 18.03,25.15 21.08,28.19 21.08,29.21 R8.P$1 21.08,29.46 39.37,29.46 41.66,31.75 IC1.23
SDA  (via drill 0.33)
  Top 0.152: 10.16,26.92 10.16,25.65 11.18,24.64 11.18,20.83 9.14,20.83 IC2.6 | 10.16,26.92 v12.7,29.46 | 10.16,26.92 R7.P$2
  Bottom 0.152: v12.7,29.46 13.21,29.46 14.99,31.24 21.59,31.24 22.86,29.97 37.34,29.97 39.12,31.75 IC1.22
SET
  Top 0.152: 77.47,32 IC1.37 77.22,31.75 77.22,29.46 65.02,17.27 65.02,5.33 64.77,5.08 BUTTONS.2
  Top 0.406: 77.47,32 77.47,33.33 R1.P$1
TXO  (via drill 0.33)
  Top 0.152: 51.82,46.99 IC1.14
  Top 0.254: v39.12,34.29 51.82,46.99
  Bottom 0.254: v39.12,34.29 11.94,34.29 11.94,32.26 7.87,28.19 7.87,25.4 6.35,23.88 6.35,22.86 5.14,21.65 FTDI.3
VCC
  Top 0.152: 33.02,76.45 IC4.1 | 59.69,31.75 IC1.30 | 60.96,24.64 AUX_A.3 | 20.83,21.84 R8.P$2 | 17.78,26.92 R7.P$1 | HT1632.VCC3 10.92,4.32 10.92,4.3 | 13.21,4.3 13.21,4.32 HT1632.VCC2 | 85.09,18.8 R10.P$1 | IC3.2 94.23,11.43 94.23,11.18 | 40.89,64.52 R13.P$1 | 53.34,65.02 53.42,65.1 | 41.91,58.17 42.04,58.29
  Top 0.406: 33.02,76.45 38.1,76.45 38.1,67.06 40.64,64.52 R13.P$1 | C4.1 67.07,54.34 64.52,56.9 64.52,58.42 61.72,61.21 57.31,61.21 C9.1 53.42,65.1 53.41,65.11 IC5.8 | 40.89,64.52 41.4,62.74 41.91,58.42 42.04,58.29 42.42,57.91 | 42.42,57.91 52.58,58.42 53.34,65.02 | JP4.3 37.85,53.34 42.42,57.91
  Top 0.61: 20.83,21.84 18.8,23.88 18.8,24.64 17.78,25.65 17.78,26.92 | PWR.1 38.16,5.14 34.54,1.52 17.27,1.52 16,2.79 16,4.24 HT1632.VCC1 HT1632.VCC2 13.21,4.3 10.92,4.3 HT1632.VCC3 10.17,4.3 8.89,6.1 8.89,14.73 | 8.89,14.73 IC2.8 | IC2.8 5.63,19.11 FTDI.4 | R5.P$2 91.25,36.89 89.15,34.8 89.15,30.28 C10.1 84.88,21.13 R10.P$1 84.88,14.18 88.65,10.41 93.47,10.41 94.23,11.18 | R4.P$2 71.46,39.26 R12.P$1 63.8,35.76 62.23,37.34 | 62.23,37.34 62.23,46.94 | 62.23,46.94 IC1.10 | 62.23,37.34 59.44,34.54 59.44,31.95 IC1.30 | 59.69,31.75 59.69,27.69 60.71,26.67 60.71,24.88 AUX_A.3 | C6.2 4.44,10.28 8.89,14.73 | IC2.8 8.9,13.2 10.41,11.68 17.02,11.68 20.07,14.73 20.07,20.78 R8.P$2 | 62.23,46.94 62.23,47.75 63.75,49.28 64.85,49.28 C4.1
  Bottom 0.152: 4.32,19.3 FTDI.4 | 21.08,21.84 R8.P$2 | 88.39,4.57 JP2.1 | R5.P$2 91.19,42.42 90.68,41.91 76.45,41.91 75.44,42.93 R4.P$2 | C5.2 35.05,14.22 40.64,8.64 40.89,8.64 41.05,8.48 | 44.96,10.67 D1.C
  Bottom 0.406: 67.31,51.56 C4.1 | 44.96,8.64 44.96,10.67 | R6.P$2 41.2,8.64
  Bottom 0.61: PWR.1 41.05,8.48 41.2,8.64 44.96,8.64 54.1,8.64 | 54.1,8.64 71.88,8.64 | 71.88,8.64 77.22,8.64 81.28,12.7 83.82,12.7 87.38,9.14 88.39,9.14 | 88.39,9.14 91.95,9.14 94.17,11.36 IC3.2 | BUTTONS.4 57.66,5.08 54.1,8.64 | JP1.3 72.03,8.49 71.88,8.64 | 88.39,9.14 88.39,4.57
WR  (via drill 0.41)
  Top 0.152: 23.62,6.86 HT1632.WR
  Top 0.254: v37.59,44.96 29.21,31.5 28.7,14.48 23.62,8.13 23.62,6.86
  Bottom 0.152: v37.59,44.96 38.61,44.7 39.37,44.7 41.66,46.99 IC1.18

### Text on the board
tNames: SPKR | IR_RECIEVE | + | 20 | 1 | RESET | RX | TX | GND | VCC | 40 | DTR | RX | +5V | GND | TX | D21 | D20 | D19 | D18 | D22 | D23 | A5 | A6 | A7 | GND | 5V | GND | Buttons | Temperature | 3.3V | +5V | MENU | SET | INCR | PHOTO-SNS | GND | D21 | + | GND | GND | 5VDC | Vin
bNames: XRONOS 2.1 | www.xronosclock.com | ANT